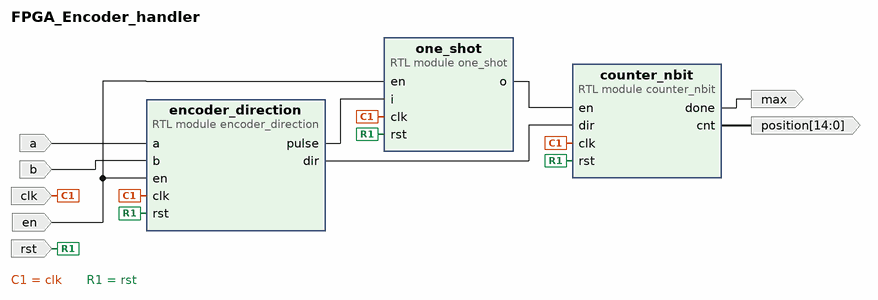
[diagram p0: block diagram of the top level]
# Vivado block design FPGA_Encoder_handler, xc7z020clg400-1, Vivado 2024.2
create_bd_design FPGA_Encoder_handler

create_bd_port -dir I a
create_bd_port -dir I b
create_bd_port -dir I -type clk clk
set_property -dict {CONFIG.ASSOCIATED_RESET rs:rst} [get_bd_ports clk]
create_bd_port -dir O max
create_bd_port -dir I en
create_bd_port -dir I -type rst rst
create_bd_port -dir O -from 14 -to 0 position

create_bd_cell -type module -reference counter_nbit counter_nbit
set_property -dict {CONFIG.max_cnt 32767 CONFIG.n_bits 15} [get_bd_cells counter_nbit]
create_bd_cell -type module -reference encoder_direction encoder_direction
create_bd_cell -type module -reference one_shot one_shot

# ---- connections ----

connect_bd_net -net a_0_1 [get_bd_ports a] [get_bd_pins encoder_direction/a]
connect_bd_net -net b_0_1 [get_bd_ports b] [get_bd_pins encoder_direction/b]
connect_bd_net -net clk_0_1 [get_bd_ports clk] [get_bd_pins encoder_direction/clk] [get_bd_pins one_shot/clk] [get_bd_pins counter_nbit/clk]
connect_bd_net -net counter_nbit_0_done [get_bd_pins counter_nbit/done] [get_bd_ports max]
connect_bd_net [get_bd_pins counter_nbit/cnt] [get_bd_ports position]
connect_bd_net -net en_0_1 [get_bd_ports en] [get_bd_pins encoder_direction/en] [get_bd_pins one_shot/en]
connect_bd_net -net encoder_direction_0_dir [get_bd_pins encoder_direction/dir] [get_bd_pins counter_nbit/dir]
connect_bd_net -net encoder_direction_0_pulse [get_bd_pins encoder_direction/pulse] [get_bd_pins one_shot/i]
connect_bd_net -net one_shot_0_o [get_bd_pins one_shot/o] [get_bd_pins counter_nbit/en]
connect_bd_net -net rst_0_1 [get_bd_ports rst] [get_bd_pins encoder_direction/rst] [get_bd_pins one_shot/rst] [get_bd_pins counter_nbit/rst]

validate_bd_design
save_bd_design
